# EAGLE schematic Stereo master section (EAGLE 9.6.2)
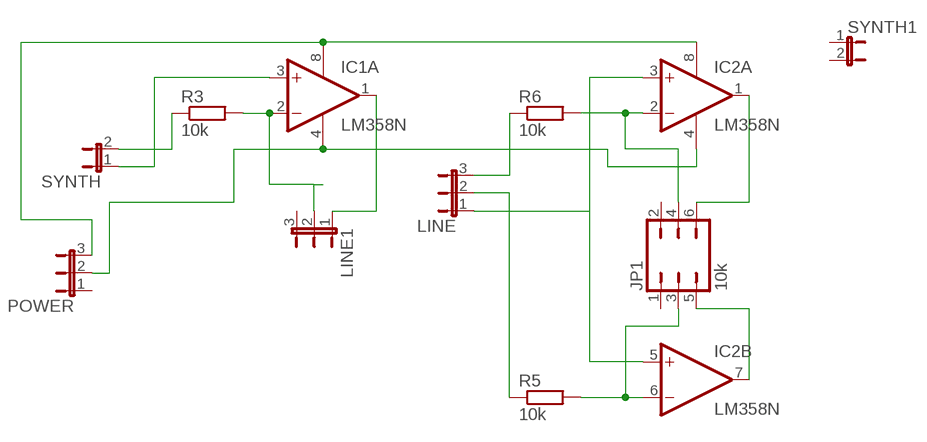
[diagram p0: schematic, sheet 1]

## Parts
IC1  LM358N  [DIL08]
IC2  LM358N  [DIL08]
JP1  10k  JP3Q  [JP3Q]
LINE  JP2E  [JP2]
LINE1  JP2E  [JP2]
POWER  JP2E  [JP2]
R3  10k  R-EU_0207/7  [0207/7]
R5  10k  R-EU_0207/7  [0207/7]
R6  10k  R-EU_0207/7  [0207/7]
SYNTH  JP1E  [JP1]
SYNTH1  JP1E  [JP1]

## Nets
N$1: R3.1 SYNTH.2
N$2: IC1.2(A:-IN) LINE1.2 R3.2
N$3: IC2.6(B:-IN) JP1.3 R5.2
N$4: IC1.3(A:+IN) SYNTH.1
N$5: LINE.2 R5.1
N$6: IC2.2(A:-IN) JP1.4 R6.2
N$7: LINE.1
N$8: LINE.3 R6.1
N$9: IC2.7(B:OUT) JP1.5
N$10: IC2.1(A:OUT) JP1.6
N$11: IC1.8(P:V+) IC2.8(P:V+) POWER.3
N$12: IC1.4(P:V-) IC2.4(P:V-) POWER.2
N$13: IC1.1(A:OUT) LINE1.1
N$17: IC2.3(A:+IN) IC2.5(B:+IN)
Unconnected: IC1.5(B:+IN) IC1.6(B:-IN) IC1.7(B:OUT) JP1.1 JP1.2 LINE1.3 POWER.1 SYNTH1.1 SYNTH1.2

## Library data of the parts
IC1 IC2 = linear:LM358: OP AMP also LM158; LM258; LM2904 Source: http://cache.national.com/ds/LM/LM158.pdf
JP1 = jumper:JP3Q: JUMPER
LINE LINE1 POWER = jumper:JP2E: JUMPER
R3 R5 R6 = rcl:R-EU_: RESISTOR, European symbol; SPICEPREFIX: R
SYNTH SYNTH1 = jumper:JP1E: JUMPER